# EAGLE design nano_neu5 (EAGLE 8.4.1)
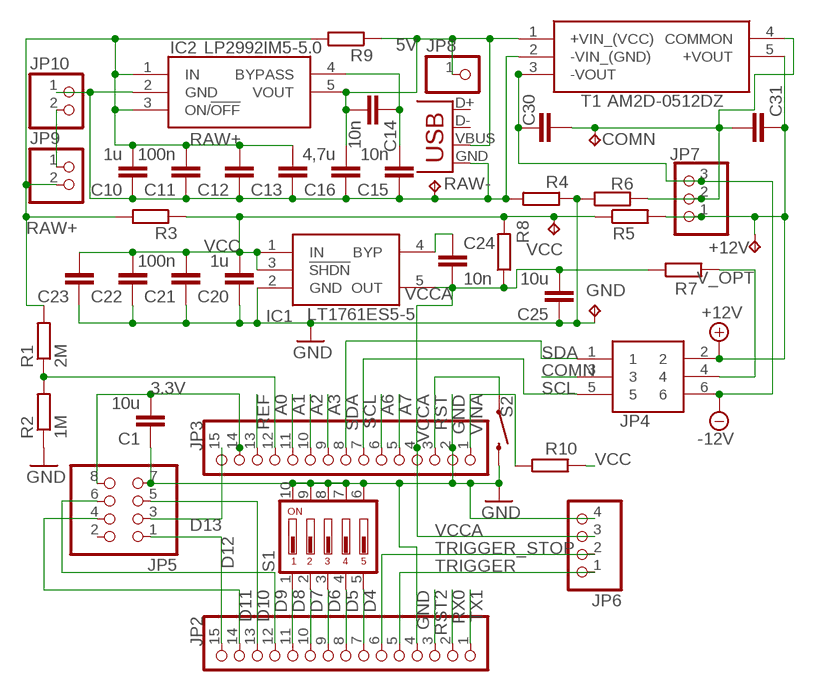
[diagram p0: schematic, sheet 1]

## Parts
+12V  TESTPAD_TPTP09SQ  [TESTPAD_TP09SQ]
C1  10u  RCL_C-EUC0805K  [RCL_C0805K]
C10  1u  RCL_C-EUC0805K  [RCL_C0805K]
C11  100n  RCL_C-EUC0805K  [RCL_C0805K]
C12  RCL_C-EUC1206K  [RCL_C1206K]
C13  RCL_C-EUC1206K  [RCL_C1206K]
C14  10n  RCL_C-EUC0805K  [RCL_C0805K]
C15  10n  RCL_C-EUC0805K  [RCL_C0805K]
C16  4,7u  RCL_C-EUC0805K  [RCL_C0805K]
C20  1u  RCL_C-EUC0805K  [RCL_C0805K]
C21  100n  RCL_C-EUC0805K  [RCL_C0805K]
C22  RCL_C-EUC1206K  [RCL_C1206K]
C23  RCL_C-EUC1206K  [RCL_C1206K]
C24  10n  RCL_C-EUC0805K  [RCL_C0805K]
C25  10u  RCL_C-EUC0805K  [RCL_C0805K]
C30  RCL_C-EUC1206K  [RCL_C1206K]
C31  RCL_C-EUC1206K  [RCL_C1206K]
COMN  TESTPAD_TPTP09SQ  [TESTPAD_TP09SQ]
GND  TESTPAD_TPTP09SQ  [TESTPAD_TP09SQ]
IC1  LT1761ES5-5  SAMACSYS_PARTS_LT1761ES5-5#TRMPBF  [SAMACSYS_PARTS_SOT95P280X100-5N]
IC2  LP2992IM5-5.0  SAMACSYS_PARTS_LP2992IM5-5.0_NOPB  [SAMACSYS_PARTS_SOT95P280X145-5N]
JP2  ADAFRUIT_PINHD-1X15-CB  [ADAFRUIT_1X15-CB]
JP3  ADAFRUIT_PINHD-1X15-CB  [ADAFRUIT_1X15-CB]
JP4  SAMACSYS_PARTS_FTSH-103-01-F-D  [SAMACSYS_PARTS_FTSH10301FD]
JP5  PINHEAD_PINHD-2X4  [PINHEAD_2X04]
JP6  PINHD-1X4-CB  [ADAFRUIT_1X04-CLEANBIG]
JP7  ADAFRUIT_PINHD-1X3CB  [ADAFRUIT_1X03-CLEANBIG]
JP8  PINHEAD_PINHD-1X1  [PINHEAD_1X01]
JP9  PINHEAD_PINHD-1X2  [PINHEAD_1X02]
JP10  PINHEAD_PINHD-1X2  [PINHEAD_1X02]
R1  2M  RCL_R-EU_R0805  [RCL_R0805]
R2  1M  RCL_R-EU_R0805  [RCL_R0805]
R3  RCL_R-EU_R0805  [RCL_R0805]
R4  RCL_R-EU_R0805  [RCL_R0805]
R5  RCL_R-EU_R0805  [RCL_R0805]
R6  RCL_R-EU_R0805  [RCL_R0805]
R7  RCL_R-EU_R0805  [RCL_R0805]
R8  RCL_R-EU_R0805  [RCL_R0805]
R9  RCL_R-EU_R0805  [RCL_R0805]
R10  RCL_R-EU_R0603  [RCL_R0603]
RAW-  RAW-  TESTPAD_TPTP09SQ  [TESTPAD_TP09SQ]
S1  SWITCH-DIL_219-05  [SWITCH-DIL_CTS-219-05]
S2  SPARKFUN-SWITCHES_MOMENTARY-SWITCH-SPST-SMD-6.0X3.5MM  [SPARKFUN-SWITCHES_TACTILE_SWITCH_SMD_6.0X3.5MM]
T1  AM2D-0512DZ  SAMACSYS_PARTS_TMA_0512D  [SAMACSYS_PARTS_TMA-0512D]
VCC  TESTPAD_TPTP09SQ  [TESTPAD_TP09SQ]
X1  CON-USB_USB-MB-S  [CON-USB_USB-MB-S]

## Nets
3.3V: C1.2 JP3.14 JP5.8
5V: C14.2 C16.2 IC2.5(VOUT) JP8.1 R9.1 T1.1(+VIN_(VCC)) X1.VBUS
+12V: +12V.TP C31.1 JP4.2 JP7.1 R5.2 T1.5(+VOUT)
-12V: C30.1 JP4.6 JP7.3 T1.3(-VOUT)
A0: JP3.12 R1.1 R2.2
A1: JP3.11
A2: JP3.10
A3: JP3.9
A6: JP3.6
A7: JP3.5
COMN: C30.2 C31.2 COMN.TP JP4.3 JP7.2 R6.2 T1.4(COMMON)
D4: JP2.7 S1.5
D5: JP2.8 S1.4
D6: JP2.9 S1.3
D7: JP2.10 S1.2
D8: JP2.11 S1.1
D9: JP2.12 JP5.6
D10: JP2.13 JP5.5
D11: JP2.14 JP5.4
D12: JP2.15 JP5.1
D13: JP3.15 JP5.3
GND: C1.1 C20.1 C21.1 C22.1 C23.1 C25.1 GND.TP IC1.2(GND) JP2.4 JP3.2 JP5.7 JP6.4 R2.1 R4.1 R6.1 S1.6 S1.7 S1.8 S1.9 S1.10 S2.2
N$1: JP9.1 JP10.2
N$14: C24.1 IC1.4(BYP)
N$20: C14.1 C15.2 IC2.4(BYPASS)
RAW+: C10.2 C11.2 C12.2 C13.2 IC2.1(IN) IC2.3(ON/!OFF) JP9.2 R1.2 R3.2 R9.2
RAW-: C10.1 C11.1 C12.1 C13.1 C15.1 C16.1 IC2.2(GND) JP10.1 R4.2 RAW-.TP T1.2(-VIN_(GND)) X1.GND
REF: JP3.13
RST: JP3.3 S2.1
RST2: JP2.3
RX0: JP2.2
SCL: JP3.7 JP4.5
SDA: JP3.8 JP4.1
TRIGGER: JP2.5 JP6.1
TRIGGER_STOP: JP2.6 JP6.2
TX1: JP2.1
V_OPT: JP4.4 R7.2
VCC: C20.2 C21.2 C22.2 C23.2 IC1.1(IN) IC1.3(!SHDN) R3.1 R5.1 R8.2 R10.1 VCC.TP
VCCA: C24.2 C25.2 IC1.5(OUT) JP3.4 JP6.3 R7.1 R8.1
VINA: JP3.1 R10.2
Unconnected: JP5.2 X1.D+ X1.D-

## Library data of the parts
+12V COMN GND RAW- VCC = CDC_Parts:TESTPAD_TP: Test pad
C1 C10-C16 C20-C25 C30 C31 = CDC_Parts:RCL_C-EU: CAPACITOR, European symbol; SPICEPREFIX: C
IC1 = CDC_Parts:SAMACSYS_PARTS_LT1761ES5-5#TRMPBF: Linear Technology LT1761ES5-3.3#TRMPBF, LDO Voltage Regulator, 100mA, 3.3 V, 1.8 20 Vin 5-Pin Source: Datasheet <https://componentsearchengine.com/Datasheets/1/LT1761ES5-3.3#TRMPBF.pdf>; DESCRIPTION: Linear Technology LT1761ES5-3.3#TRMPBF, LDO Voltage Regulator, 100mA, 3.3 V, 1.8 20 Vin 5-Pin; HEIGHT: 1mm; MANUFACTURER_NAME: Linear Technology; MANUFACTURER_PART_NUMBER: LT1761ES5-3.3#TRMPBF; MOUSER_PART_NUMBER: 584-1761ES5-3.3TMPF; MOUSER_PRICE-STOCK: https://www.mouser.com/Search/Refine.aspx?Keyword=584-1761ES5-3.3TMPF
IC2 = CDC_Parts:SAMACSYS_PARTS_LP2992IM5-5.0_NOPB: Micropower 250 mA Low-Noise Ultra Low-Dropout Regulator Source: Datasheet <http://www.ti.com/lit/ds/symlink/lp2992.pdf>; DESCRIPTION: Micropower 250 mA Low-Noise Ultra Low-Dropout Regulator; HEIGHT: 1.45mm; MANUFACTURER_NAME: Texas Instruments; MANUFACTURER_PART_NUMBER: LP2992IM5-5.0/NOPB; MOUSER_PART_NUMBER: 926-2992IM5-5.0/NOPB; MOUSER_PRICE-STOCK: https://www.mouser.com/Search/Refine.aspx?Keyword=926-2992IM5-5.0%2FNOPB
JP2 JP3 = CDC_Parts:ADAFRUIT_PINHD-1X15: PIN HEADER
JP4 = CDC_Parts:SAMACSYS_PARTS_FTSH-103-01-F-D: Conn Unshrouded Header HDR 6 POS 1.27mm Solder ST Thru-Hole Source: Datasheet <https://componentsearchengine.com/Datasheets/1/FTSH-103-01-F-D.pdf>; DESCRIPTION: Conn Unshrouded Header HDR 6 POS 1.27mm Solder ST Thru-Hole; HEIGHT: 5.56mm; MANUFACTURER_NAME: SAMTEC; MANUFACTURER_PART_NUMBER: FTSH-103-01-F-D; MOUSER_PART_NUMBER: 200-FTSH10301FD; MOUSER_PRICE-STOCK: https://www.mouser.com/Search/Refine.aspx?Keyword=200-FTSH10301FD
JP5 = CDC_Parts:PINHEAD_PINHD-2X4: PIN HEADER
JP6 = CDC_Parts:PINHD-1X4-CB
JP7 = CDC_Parts:ADAFRUIT_PINHD-1X3: PIN HEADER
JP8 = CDC_Parts:PINHEAD_PINHD-1X1: PIN HEADER
JP9 JP10 = nano_neu3:PINHEAD_PINHD-1X2: PIN HEADER
R1-R10 = CDC_Parts:RCL_R-EU_: RESISTOR, European symbol; SPICEPREFIX: R
S1 = CDC_Parts:SWITCH-DIL_219-05*: Surface Mount DIP Switch Series 219 SMT CTS Electronic Components Sourc: www.ctscorp.com; OC_FARNELL: unknown; OC_NEWARK: unknown
S2 = CDC_Parts:SPARKFUN-SWITCHES_MOMENTARY-SWITCH-SPST: Momentary Switch (Pushbutton) - SPST Normally-open (NO) SPST momentary switches (buttons, pushbuttons). Variants PTH-12MM - 12mm square, through-hole Momentary Pushbutton Switch - 12mm Square <https://www.sparkfun.com/products/9190> (COM-09190) PTH-6.0MM, PTH-6.0MM-KIT - 6.0mm square, through-hole Mini Pushbutton Switch <https://www.sparkfun.com/products/97> (COM-00097) KIT package intended for soldering kit's - only one side of pads' copper is exposed. PTH-RIGHT-ANGLE-KIT - Right-angle, through-hole Right Angle Tactile Button <https://www.sparkfun.com/products/10791> - Used on SparkFun BigTime Watch Kit <https://www.sparkfun.com/products/11734> SMD-12MM - 12mm square, surface-mount Tactile Button - SMD (12mm) <https://www.sparkfun.com/products/12993> (COM-12993) Used on SparkFun PicoBoard <https://www.sparkfun.com/products/11888> SMD-4.5MM - 4.5mm Square Trackball Switch Used on SparkFun Blackberry Trackballer Breakout <https://www.sparkfun.com/products/13169> SMD-4.6MMX2.8MM - 4.60mm x 2.80mm, surface mount Used on SparkFun SAMD21 Mini Breakout <https://www.sparkfun.com/products/13664> SMD-5.2MM, SMD-5.2-REDUNDANT - 5.2mm square, surface-mount Mini Pushbutton Switch - SMD <https://www.sparkfun.com/products/8720> (COM-08720) Used on Arduino Pro Mini <https://www.sparkfun.com/products/11114> REDUNDANT package connects both switch circuits together SMD-6.0X3.5MM - 6.0 x 3.5mm, surface mount Momentary Reset Switch SMD <https://www.sparkfun.com/products/8229> (COM-08229) SMD-6.2MM-TALL - 6.2mm square, surface mount Tactile Button - SMD (6mm) <https://www.sparkfun.com/products/12992> Used on SparkFun Digital Sandbox <https://www.sparkfun.com/products/12651> SMD-RIGHT-ANGLE - Right-angle, surface mount Used on SparkFun Block for Intel® Edison - Arduino <https://www.sparkfun.com/products/13036>; PROD_ID: SWCH-00815; SF_SKU: COM-08229
T1 = CDC_Parts:SAMACSYS_PARTS_TMA_0512D: TMA0512D unregulated DC-DC,+/-12V 1W TRACOPOWER 1W Isolated DC-DC Converter, Vin 4.5 5.5 V dc, Vout +/-12V dc, I/O isolation 1000V dc Source: Datasheet <https://componentsearchengine.com/Datasheets/1/TMA 0512D.pdf>; DESCRIPTION: TMA0512D unregulated DC-DC,+/-12V 1W TRACOPOWER 1W Isolated DC-DC Converter, Vin 4.5 5.5 V dc, Vout +/-12V dc, I/O isolation 1000V dc; HEIGHT: mm; MANUFACTURER_NAME: Traco Power; MANUFACTURER_PART_NUMBER: TMA 0512D; MOUSER_PART_NUMBER: 495-TMA-0512D; MOUSER_PRICE-STOCK: https://www.mouser.com/Search/Refine.aspx?Keyword=495-TMA-0512D
X1 = CDC_Parts:CON-USB_USB: USB Connectors

## Board
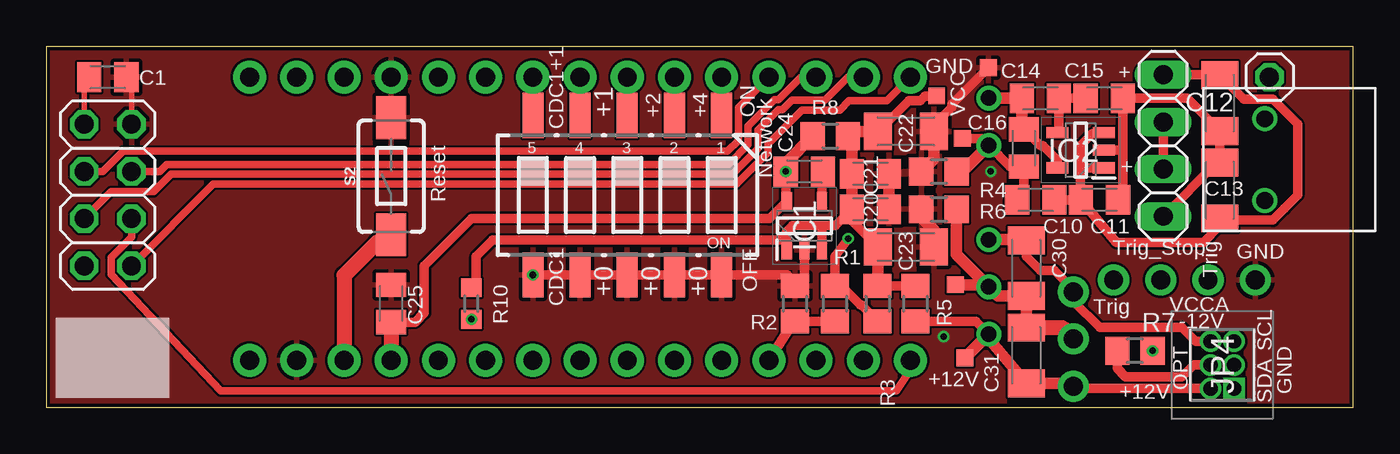
[diagram p1: board, top side]
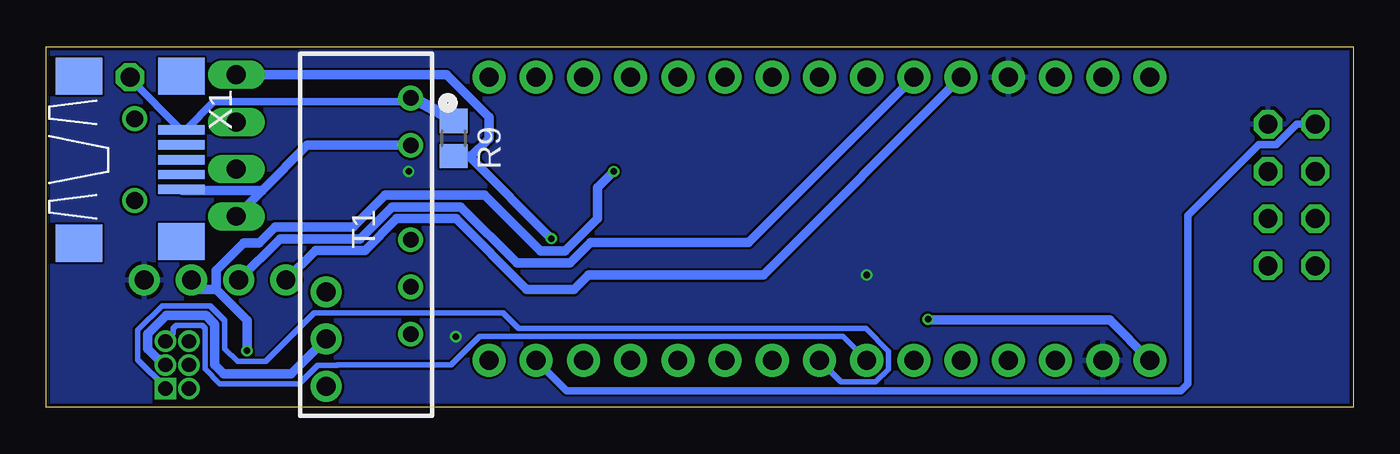
[diagram p2: board, bottom side, seen from below]

Size 70.28 x 19.42 mm. Coordinates in mm from the lower left corner, seen from the top.
Outline: 0,0 70.28,0 70.28,19.42 0,19.42 0,0
Copper layers (1*16): Top 0.018mm / dielectric 1.55mm / Bottom 0.018mm
Design rules "Multi-CB_2L_125um-Tracks_OL35um *": minimum track width 0.125mm, minimum drill 0.2mm, track to track 0.125mm, track to pad 0.125mm, pad to pad 0.1mm, via to via 0.125mm, smd to smd 0mil, copper to edge 0.2mm, drill to drill 0.2mm, minimum pad ring 0.125mm, minimum via ring 0.125mm, stop-mask expansion 2mil, vias tented up to drill 0.45mm, thermal gap 0.2mm

### Footprints (pad centres in the part's own frame; a part is rotated, then mirrored left to right if it is on the bottom)
TESTPAD_TP09SQ = smd 0.9 x 0.9: TP 0,0
RCL_C0805K = smd 1.3 x 1.6: 1 -1,0; 2 1,0
RCL_C1206K = smd 1.5 x 2: 1 -1.5,0; 2 1.5,0
SAMACSYS_PARTS_SOT95P280X100-5N = smd 1.05 x 0.55: 1 -1.3,0.95; 2 -1.3,0; 3 -1.3,-0.95; 4 1.3,-0.95; 5 1.3,0.95
SAMACSYS_PARTS_SOT95P280X145-5N = smd 1.2 x 0.6: 1 -1.25,0.95; 2 -1.25,0; 3 -1.25,-0.95; 4 1.25,-0.95; 5 1.25,0.95
ADAFRUIT_1X15-CB = drill 1.016 pad 1.778: 1 -17.78,0; 2 -15.24,0; 3 -12.7,0; 4 -10.16,0; 5 -7.62,0; 6 -5.08,0; 7 -2.54,0; 8 0,0; 9 2.54,0; 10 5.08,0; 11 7.62,0; 12 10.16,0; 13 12.7,0; 14 15.24,0; 15 17.78,0
SAMACSYS_PARTS_FTSH10301FD = drill 0.77 pad 1.1 square: 1 0,0 | drill 0.77 pad 1.1: 2 0,1.27; 3 1.27,0; 4 1.27,1.27; 5 2.54,0; 6 2.54,1.27
PINHEAD_2X04 = drill 1.016 octagon: 1 -3.81,-1.27; 2 -3.81,1.27; 3 -1.27,-1.27; 4 -1.27,1.27; 5 1.27,-1.27; 6 1.27,1.27; 7 3.81,-1.27; 8 3.81,1.27
ADAFRUIT_1X04-CLEANBIG = drill 1.016 pad 1.676: 1 -2.54,0; 2 0,0; 3 2.54,0; 4 5.08,0
ADAFRUIT_1X03-CLEANBIG = drill 1.016 pad 1.676: 1 -2.54,0; 2 0,0; 3 2.54,0
PINHEAD_1X01 = drill 1.016 octagon: 1 0,0
PINHEAD_1X02 = drill 1.016 long: 1 -1.27,0; 2 1.27,0
RCL_R0805 = smd 1.3 x 1.5: 1 -0.95,0; 2 0.95,0
RCL_R0603 = smd 1 x 1.1: 1 -0.85,0; 2 0.85,0
SWITCH-DIL_CTS-219-05 = smd 1.13 x 2.44: 1 -5.08,-4.3; 2 -2.54,-4.3; 3 0,-4.3; 4 2.54,-4.3; 5 5.08,-4.3; 6 5.08,4.3; 7 2.54,4.3; 8 0,4.3; 9 -2.54,4.3; 10 -5.08,4.3
SPARKFUN-SWITCHES_TACTILE_SWITCH_SMD_6.0X3.5MM = smd 2.3 x 1.6: 1 -3.15,0; 2 3.15,0
SAMACSYS_PARTS_TMA-0512D = drill 0.83 pad 1.33: 1 2.4,5.95; 2 4.94,5.95; 3 10.02,5.95; 4 12.56,5.95; 5 15.1,5.95
CON-USB_USB-MB-S = smd 2.5 x 0.5: D+ 2.5,0; D- 2.5,0.8; GND 2.5,-1.6; ID 2.5,-0.8; VBUS 2.5,1.6 | smd 2.5 x 2: P$1 -3,-4.5; P$2 -3,4.5; P$3 2.5,-4.4; P$4 2.5,4.5 | drill 0.9: P$5 0,2.2; P$6 0,-2.2

### Placement (x,y rotation side)
+12V  49.4,2.67 0 top
C1  3.3,17.78 180 top
C10  53.21,11.18 0 top
C11  56.64,11.18 180 top
C12  63.12,16.38 90 top
C13  63.12,11.68 270 top
C14  53.47,16.64 180 top
C15  56.9,16.64 180 top
C16  52.58,13.97 90 top
C20  44.32,10.67 180 top
C21  44.32,12.57 180 top
C22  46.23,14.86 180 top
C23  46.23,8.64 180 top
C24  40.77,12.7 180 top
C25  18.54,5.59 270 top
C30  52.7,7.49 270 top
C31  52.7,2.79 90 top
COMN  48.9,6.6 0 top
GND  50.67,18.29 0 top
IC1  40.77,9.78 90 top
IC2  55.63,13.84 180 top
JP2  28.7,17.78 0 top
JP3  28.7,2.54 0 top
JP4  63.88,1.02 90 top
JP5  3.3,11.43 90 top
JP6  59.94,6.86 0 top
JP7  55.24,3.68 90 top
JP8  65.79,17.78 0 top
JP9  60.07,16.64 90 top
JP10  60.07,11.56 90 top
R1  42.42,5.59 90 top
R2  40.26,5.59 270 top
R3  44.7,5.59 270 top
R4  48.01,12.7 0 top
R5  46.74,5.59 270 top
R6  48.01,10.67 0 top
R7  58.55,3.05 180 top
R8  42.16,14.61 0 top
R9  48.39,14.48 270 bottom
R10  22.86,5.59 270 top
RAW-  49.28,14.48 0 top
S1  31.24,11.43 180 top
S2  18.54,12.45 90 top
T1  56.64,19.05 270 bottom
VCC  47.88,16.76 0 top
X1  65.53,13.34 0 bottom

### Tracks (layer width: path | path; a pad name or v marks a point on that pad's centre or on a via)
3.3V
  Top 0.305: JP5.8 2.03,17.51 C1.2
  Bottom 0.406: JP5.8 3.03,15.24 4.12,14.15 5.08,14.15 8.89,10.34 8.89,1.27 9.27,0.89 42.3,0.89 JP3.14
5V
  Top 0.508: C16.2 53.45,14.1 53.59,14.1 54.38,13.31 IC2.5
  Top 0.61: T1.1 50.7,16.64 C14.2 52.47,14.86 C16.2
  Bottom 0.406: JP8.1 65.79,17.69 X1.VBUS 62.81,14.94 61.28,16.46 50.88,16.46 T1.1
  Bottom 0.61: R9.1 50.64,16.7 T1.1
+12V
  Top 0.508: T1.5 50,4.64 R5.2 | JP4.2 55.37,1.02
  Top 0.61: +12V.TP T1.5 | T1.5 50.69,3.69 C31.1 55.09,1.29 JP7.1 55.37,1.02 | T1.5 +12V.TP
-12V
  Top 0.508: JP4.6 61.81,3.56 61.07,4.3 56.66,4.3 55.24,5.71 JP7.3 55.24,6.35 54.23,7.37 53.47,7.37 52.7,8.13 C30.1
  Top 0.61: 51.6,9.03 T1.3 53.05,9.03 C30.1
A0
  Top 0.508: R1.1 R2.2 40.13,4.51 JP3.12
COMN
  Top 0.61: T1.4 48.96,8.23 R6.2 | T1.4 51.19,5.99 C30.2 C31.2 | COMN.TP 50.58,6.6 T1.4
  Top 0.813: C31.2 54.63,4.29 JP7.2
  Bottom 0.508: JP4.3 64.19,2.6 64.28,2.6 64.84,3.16 64.84,3.95 63.85,4.94 61.7,4.94 61.23,4.47 61.23,2.29 60.74,1.8 57.13,1.8 JP7.2
D4
  Top 0.508: JP2.7 S1.5
D5
  Top 0.508: JP2.8 S1.4
D6
  Top 0.508: JP2.9 S1.3
D7
  Top 0.508: JP2.10 S1.2
D8
  Top 0.508: JP2.11 S1.1
D9
  Top 0.406: JP2.12 37.22,16.13 37.22,14.37 36.63,13.79 4.12,13.79 3.03,12.7 JP5.6
D10
  Top 0.406: JP5.5 6.1,12.7 6.48,13.08 36.67,13.08 37.75,14.15 37.75,15.14 39.17,16.56 39.37,16.56 40.58,17.78 JP2.13
D11
  Top 0.406: JP5.4 3.48,11.61 5.76,11.61 6.7,12.55 36.89,12.55 38.28,13.93 38.28,14.92 39.39,16.03 39.59,16.03 40.09,16.54 41.88,16.54 43.12,17.78 JP2.14
D12
  Top 0.406: JP5.1 8.97,12.02 37.11,12.02 38.81,13.71 38.81,14.18 40.64,16.01 42.68,16.01 43.18,16.51 45.21,16.51 JP2.15
D13
  Top 0.406: JP5.3 4.57,9.16 3.48,8.07 3.48,7.17 9.38,0.89 45.72,0.89 46.48,2.03 JP3.15
GND  (via drill 0.35)
  Top 0.305: JP5.7 4.57,17.51 C1.1
  Top 0.508: S1.6 S1.7 S1.8 S1.9 S1.10 39.86,7.13 40.35,6.63 | GND.TP 48.71,16.32 48.71,16.16 47.73,15.18 C22.1 | 40.35,6.63 40.77,7.05 IC1.2 | 40.35,6.63 R2.1
  Top 0.61: C20.1 C21.1 | C22.1 47.73,13.37 R4.1 | R6.1 47.06,10.22 47.75,9.53 47.75,8.66 C23.1
  other vias: 26.16,7.13 50.8,12.7 48.26,3.81
  pour Bottom: -0.51,20.32 -0.51,-1.27 71.88,-1.27 71.88,20.32
  pour Top: -0.51,19.43 -0.51,0 70.61,0 70.61,19.43
N$1
  Top 0.508: JP9.1 JP10.2
N$14
  Top 0.508: IC1.4 41.72,12.65 C24.1
N$20
  Top 0.508: IC2.4 54.47,14.88 C14.1 C15.2
  Top 0.813: 54.5,16.6 C14.1
RAW+  (via drill 0.35)
  Top 0.508: R3.2 43.83,5.51 43.8,5.51 42.77,6.54 R1.2 42.42,8.13 v43.13,9.09 | IC2.3 56.81,14.73 56.26,14.73 55.63,14.1 55.63,12.7 | 55.63,12.7 55.63,11.54 C11.2 | IC2.1 55.82,12.89 55.63,12.7 | JP9.2 63.09,17.91 C12.2 64.41,16.59 65.97,16.59 67.31,15.25 67.31,11.43 66.59,10.71 66.59,10.7 65.97,10.08 63.22,10.08 C13.2 63.12,9.78 62.23,8.89 57.55,8.89 C11.2 | C10.2 C11.2
  Bottom 0.508: R9.2 47.56,13.53 47.5,13.46 | 47.5,13.46 v43.13,9.09 | JP9.2 48.77,17.91 46.48,15.62 46.48,14.48 47.5,13.46
RAW-
  Top 0.508: RAW-.TP 50.32,14.48 T1.2 51.83,12.97 C16.1 52.58,11.92 C10.1 | IC2.2 57.91,13.84 | 57.91,13.84 57.91,16.62 C15.1 61.37,16.64 C12.1 C13.1 62.97,13.18 JP10.1 | 57.91,13.84 57.91,11.83 C11.1 57.63,10.8
  Top 0.61: T1.2 49.28,12.7 R4.2
  Bottom 0.508: T1.2 56.25,14.11 58.67,11.68 | 58.67,11.68 JP10.1 | X1.GND 62.98,11.68 58.67,11.68
RST
  Top 0.813: S2.1 18.14,8.89 17.78,8.89 16,7.11 JP3.3
SCL
  Bottom 0.305: JP3.7 27.43,3.81 46.99,3.81 48.51,2.29 54.61,2.29 54.64,2.26 55.71,2.26 56.7,1.27 60.96,1.27 61.76,2.07 61.76,4.25 61.92,4.41 63.3,4.41 63.47,4.25 63.47,3.97 JP4.5
SDA
  Bottom 0.305: JP3.8 27.54,1.37 25.68,1.37 25,2.06 25,3.02 26.21,4.24 44.88,4.24 45.72,5.08 55.88,5.08 58.49,2.47 60,2.47 60.69,3.16 60.69,4.69 61.48,5.47 64.07,5.47 65.37,4.17 65.37,2.56 63.88,1.08 JP4.1
TRIGGER
  Bottom 0.508: JP2.5 31.72,7.14 41.12,7.14 41.91,6.35 44.45,6.35 48.26,10.16 51.44,10.16 53.15,8.45 55.82,8.45 JP6.1
TRIGGER_STOP
  Bottom 0.508: JP2.6 32.51,8.89 41.02,8.89 42.13,7.78 44.98,7.78 48,10.79 51.7,10.79 53.41,9.08 57.72,9.08 JP6.2
V_OPT
  Top 0.508: JP4.4 61.72,2.29 61.09,1.65 58.04,1.65 57.6,2.09 R7.2
VCC
  Top 0.508: R5.1 R3.1 | C22.2 46.38,16.51 47.01,16.51 47.26,16.76 VCC.TP | C23.2 43.32,10.04 C20.2 42.43,9.78 41.53,9.78 | 39.82,8.89 IC1.1 | 39.82,8.89 39.82,9.46 40.13,9.78 41.53,9.78 | IC1.3 41.72,9.59 41.53,9.78 | R10.1 23.11,6.69 23.11,8.13 24,9.02 39.69,9.02 39.82,8.89
  Top 0.61: C20.2 C21.2 43.32,14.4 R8.2 43.37,14.86 C22.2 | 45.09,8.28 C23.2 44.73,6.56 R3.1
VCCA  (via drill 0.35)
  Top 0.508: C25.2 19.83,4.59 20.32,5.08 20.32,7.62 22.86,10.16 38.9,10.16 IC1.5 39.77,11.13 C24.2
  Top 0.61: C24.2 39.77,13.16 R8.1
  Top 0.813: C25.2 JP3.4
  Bottom 0.508: C24.2 40.64,11.83 40.64,10.16 42.39,8.41 43.71,8.41 46.73,11.43 52.07,11.43 53.79,9.71 57.99,9.71 58.84,8.86 59.66,8.86 61.16,7.36 61.16,6.35 | JP6.3 61.98,6.35 61.16,6.35 | 61.16,6.35 59.5,4.69 R7.1
  other vias: 39.77,12.7 59.5,3.05
VINA  (via drill 0.35)
  Bottom 0.508: JP3.1 13.08,4.7 22.86,4.7 R10.2
  other vias: 22.86,4.74

### Text on the board
tNames: + | Network | +1 | +2 | +4 | ON | CDC1+1 | + | Reset | Trig_Stop | GND | Trig | +0 | +0 | +0 | OFF | Trig | VCCA | CDC1 | -12V | OPT | SCL | GND | +12V | SDA